# EAGLE design 405_led_jetracer020000N (EAGLE 9.6.2)

## Sheet 1 of 2
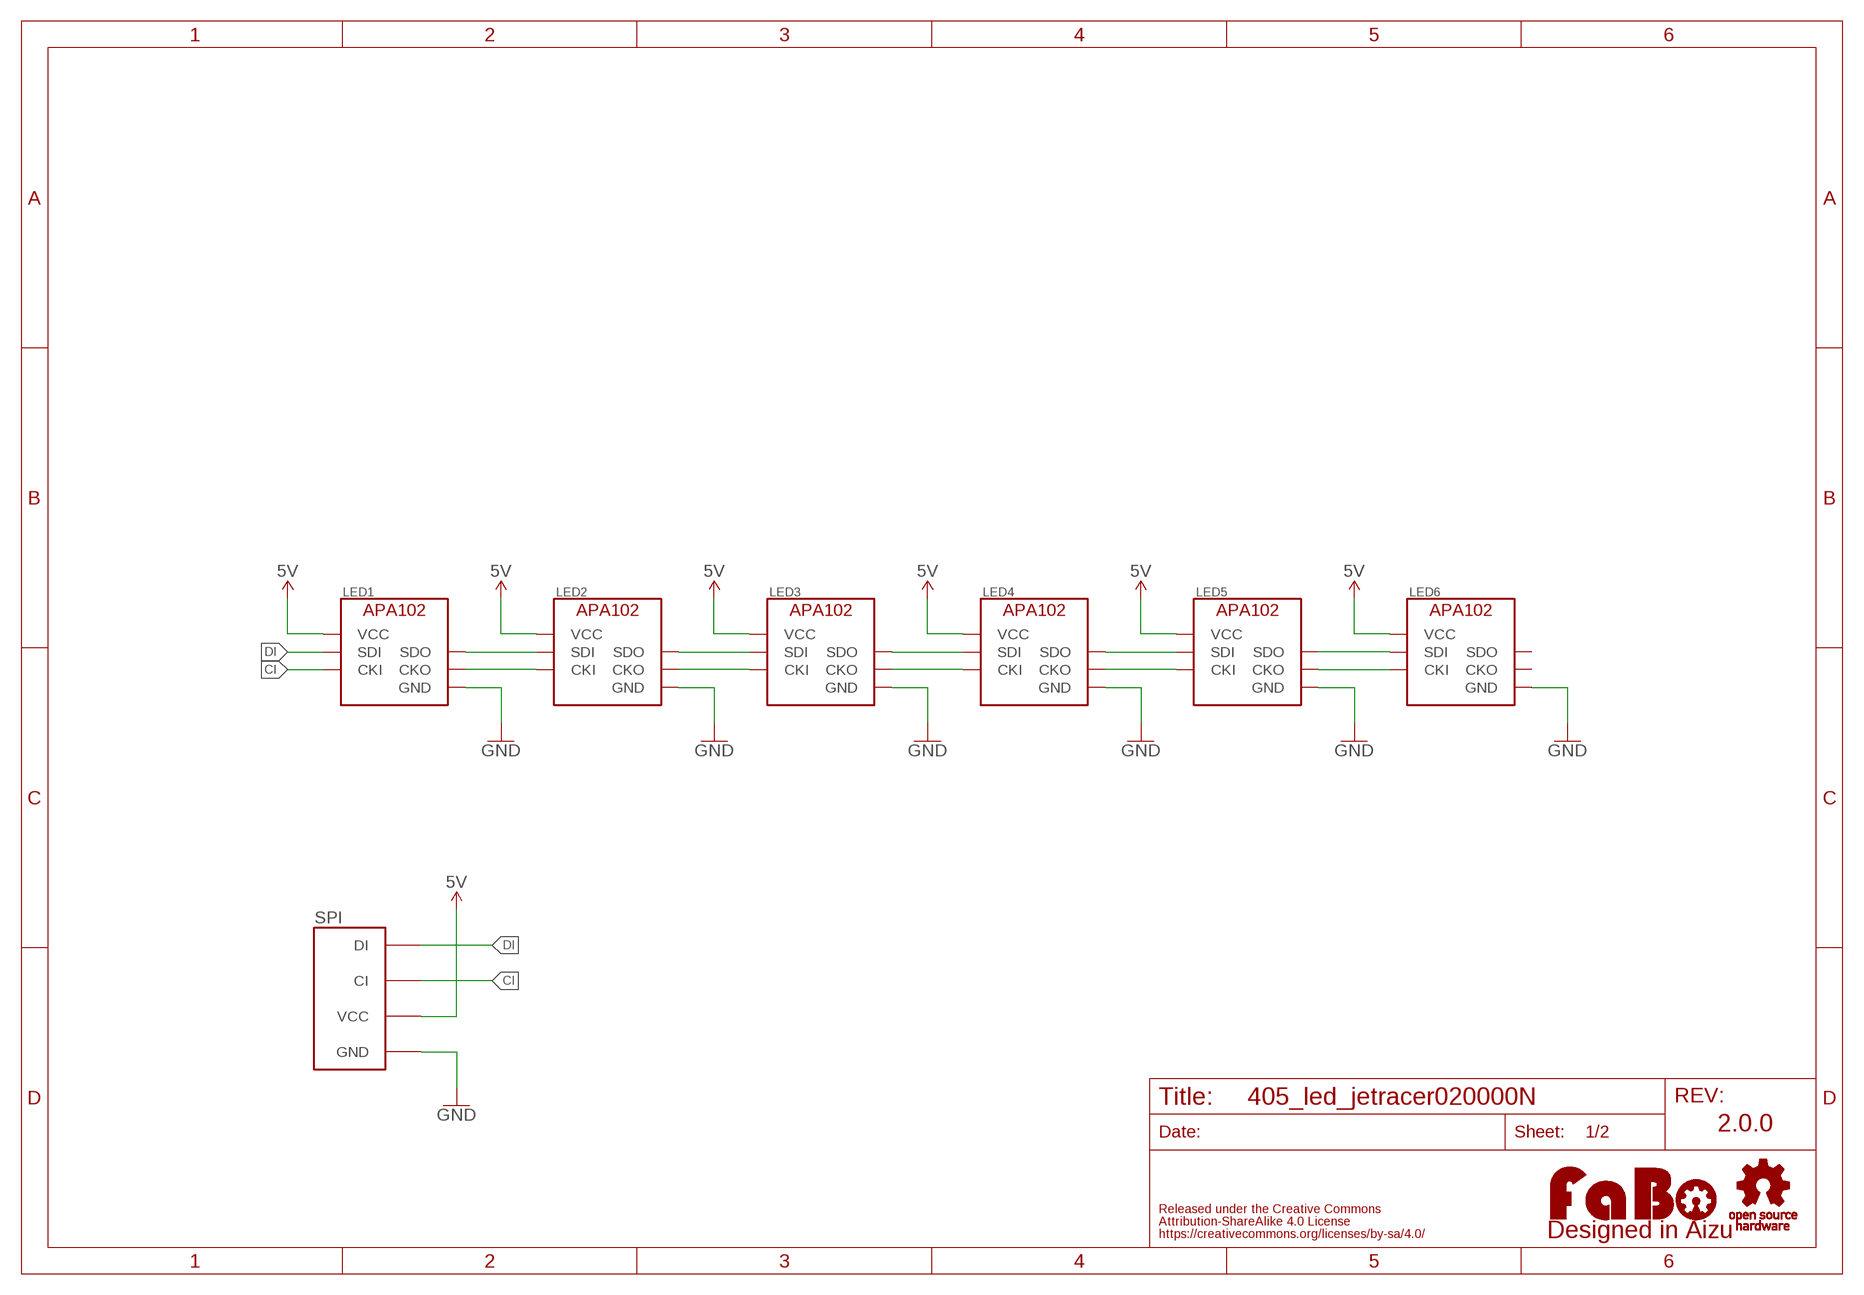
[diagram p0: schematic, sheet 1]

### Parts
LED1  APA102_IPIXEL  [APA102_2020]
LED2  APA102_IPIXEL  [APA102_2020]
LED3  APA102_IPIXEL  [APA102_2020]
LED4  APA102_IPIXEL  [APA102_2020]
LED5  APA102_IPIXEL  [APA102_2020]
LED6  APA102_IPIXEL  [APA102_2020]
LOGO1  LOGO_OSHW-S_BOTTOM  [LOGO_OSHW_S_BOTTOM]
LOGO2  LOGO_FABO-S  [LOGO_FABO_S]
SPI  FABO-SPI-LED-B04B  [SPI-B04B-PASK-1]

### Nets
5V: LED1.VCC LED2.VCC LED3.VCC LED4.VCC LED5.VCC LED6.VCC SPI.VCC
CI: LED1.CKI SPI.CI
CI1: LED1.CKO LED2.CKI
CI2: LED2.CKO LED3.CKI
CI3: LED3.CKO LED4.CKI
CI4: LED4.CKO LED5.CKI
CI5: LED5.CKO LED6.CKI
DI: LED1.SDI SPI.DI
DI1: LED1.SDO LED2.SDI
DI2: LED2.SDO LED3.SDI
DI3: LED3.SDO LED4.SDI
DI4: LED4.SDO LED5.SDI
DI5: LED5.SDO LED6.SDI
GND: LED1.GND LED2.GND LED3.GND LED4.GND LED5.GND LED6.GND SPI.GND
Unconnected: LED6.CKO LED6.SDO

### Notes on the sheet
- 2.0.0

## Sheet 2 of 2
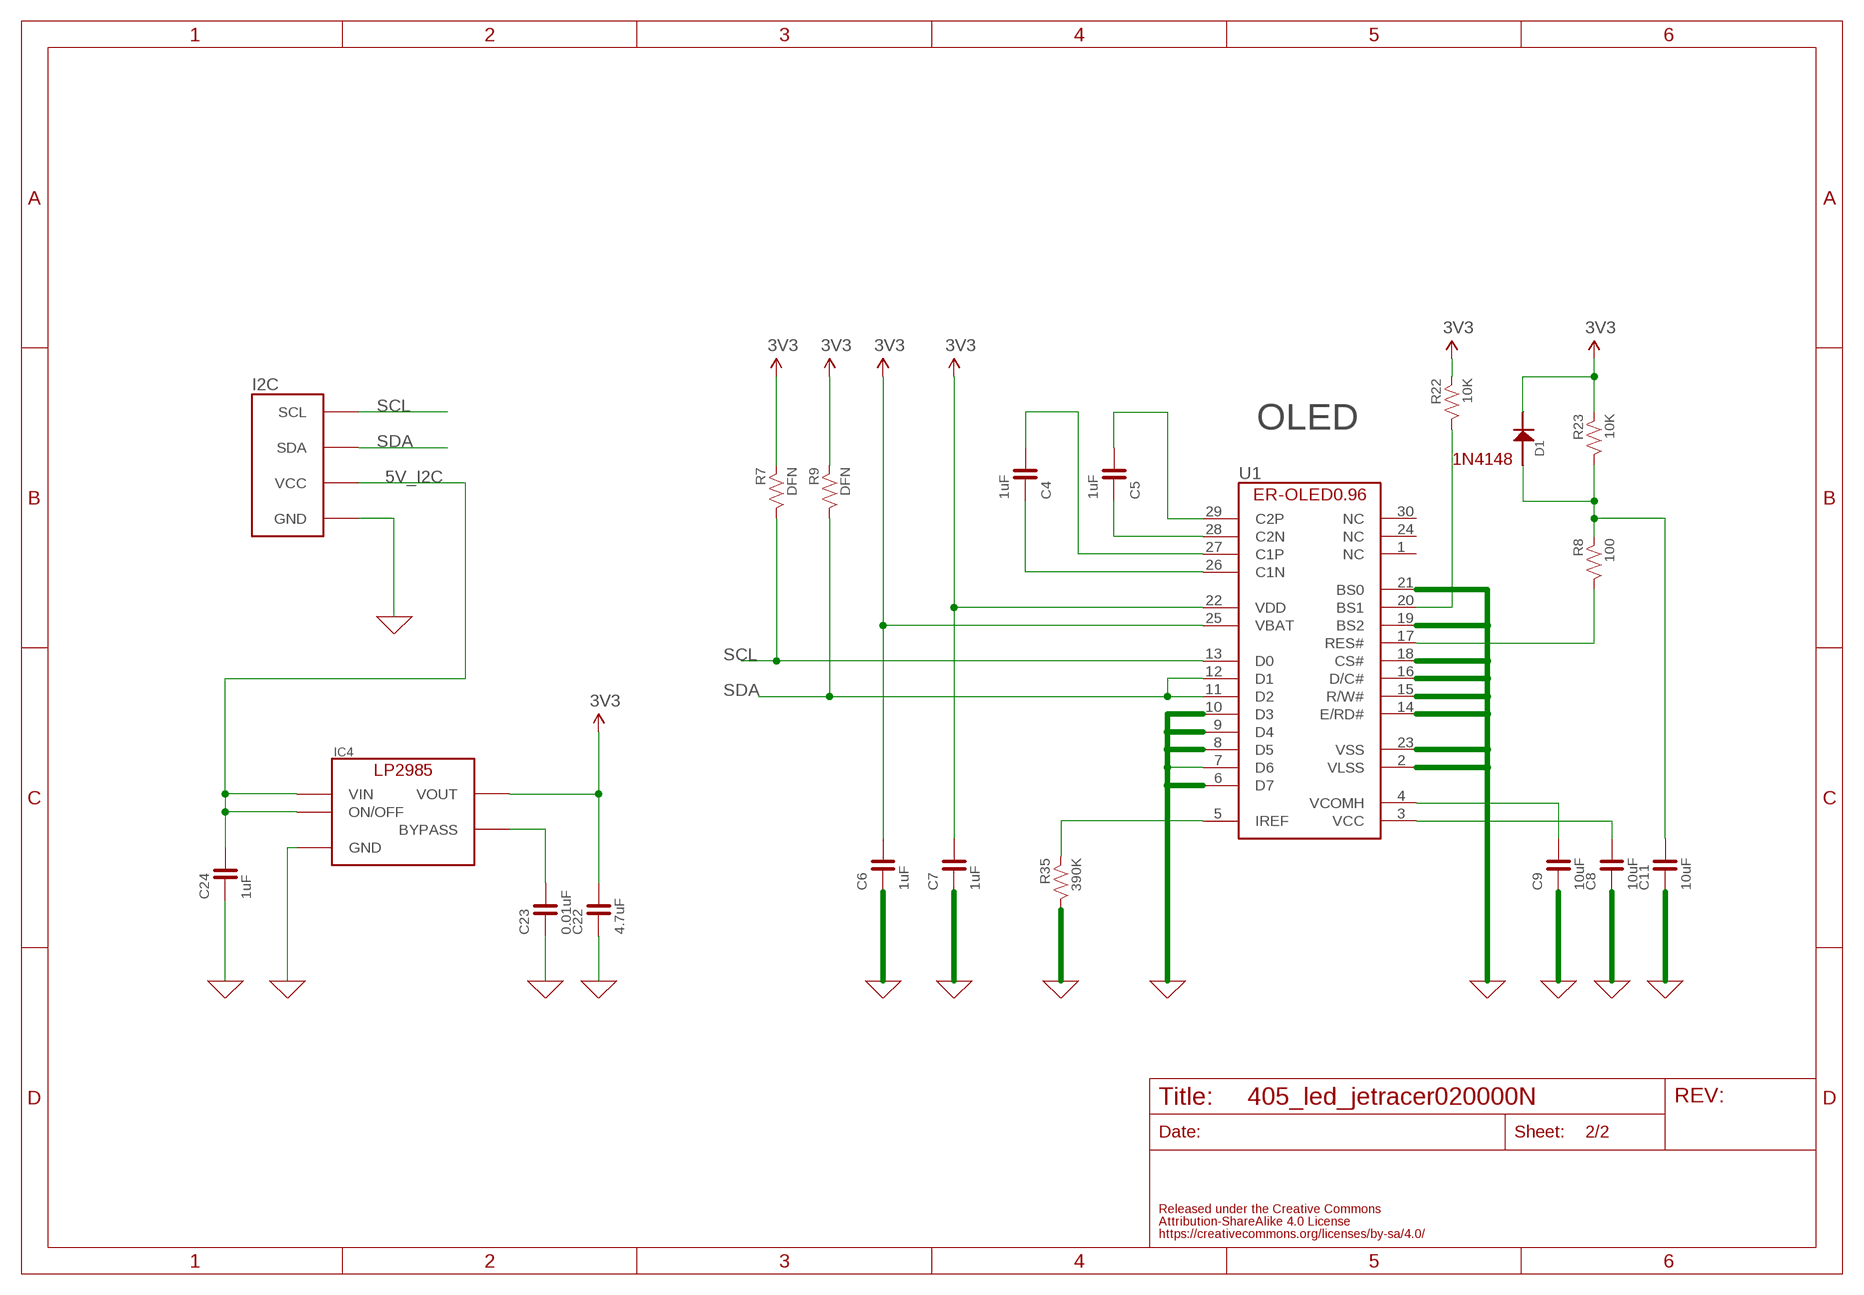
[diagram p1: schematic, sheet 2]

### Parts
C4  1uF  CAPACITOR-0603  [0603]
C5  1uF  CAPACITOR-0603  [0603]
C6  1uF  CAPACITOR-0603  [0603]
C7  1uF  CAPACITOR-0603  [0603]
C8  10uF  CAPACITOR-0603  [0603]
C9  10uF  CAPACITOR-0603  [0603]
C11  10uF  CAPACITOR-0603  [0603]
C22  4.7uF  CAPACITOR-0603  [0603]
C23  0.01uF  CAPACITOR-0603  [0603]
C24  1uF  CAPACITOR-0603  [0603]
D1  1N4148  [1N4148W]
I2C  FABO_BRICK_I2C-B04B-PASK-1  [FABO_BRICK_I2C_B04B-PASK-1]
IC4  LP2985-33DBV  [SOT-23-5]
R7  DFN  RESISTOR-0603  [0603]
R8  100  RESISTOR-0603  [0603]
R9  DFN  RESISTOR-0603  [0603]
R22  10K  RESISTOR-0603  [0603]
R23  10K  RESISTOR-0603  [0603]
R35  390K  RESISTOR-0603  [0603]
U1  ER-OLED0.96-1ER-CON30HT-1  [ER-CON30HT-1]

### Nets
0: C6.1 C7.1 C8.1 C9.1 C11.1 C22.1 C23.1 C24.1 I2C.GND IC4.2(GND) R35.2 U1.2(VLSS) U1.6(D7) U1.7(D6) U1.8(D5) U1.9(D4) U1.10(D3) U1.14(E/RD#) U1.15(R/W#) U1.16(D/C#) U1.18(CS#) U1.19(BS2) U1.21(BS0) U1.23(VSS) ; supply symbol labelled GND
3V3: C6.2 C7.2 C22.2 D1.CATHODE IC4.5(VOUT) R7.1 R9.1 R22.1 R23.1 U1.22(VDD) U1.25(VBAT)
5V_I2C: C24.2 I2C.VCC IC4.1(VIN) IC4.3(ON/OFF)
N$2: C23.2 IC4.4(BYPASS)
N$16: C4.2 U1.27(C1P)
N$21: C4.1 U1.26(C1N)
N$22: C5.1 U1.28(C2N)
N$23: C5.2 U1.29(C2P)
N$24: R35.1 U1.5(IREF)
N$25: C9.2 U1.4(VCOMH)
N$26: C8.2 U1.3(VCC)
N$27: R8.2 U1.17(RES#)
N$28: C11.2 D1.ANODE R8.1 R23.2
N$50: R22.2 U1.20(BS1)
SCL: I2C.SCL R7.2 U1.13(D0)
SDA: I2C.SDA R9.2 U1.11(D2) U1.12(D1)
Unconnected: U1.1(NC) U1.24(NC) U1.30(NC)

### Notes on the sheet
- OLED
- 1N4148

## Library data of the parts
C4-C9 C11 C22-C24 = FaBo-Capacitor:CAPACITOR: CAPACITOR
D1 = FaBo-Diode:1N4148
I2C = FaBo-Template:FABO_BRICK_I2C: FaBo Brick I2C
IC4 = FaBo-Supply:LP2985: LP2985
LED1-LED6 = FaBo-LED:APA102
LOGO1 = FaBo-Logo:LOGO_OSHW
LOGO2 = FaBo-Logo:LOGO_FABO
R7-R9 R22 R23 R35 = FaBo-Resistors:RESISTOR: RESISTOR
SPI = FaBo-Connetor:FABO-SPI-LED
U1 = FaBo-Display:ER-OLED0.96-1

## Board
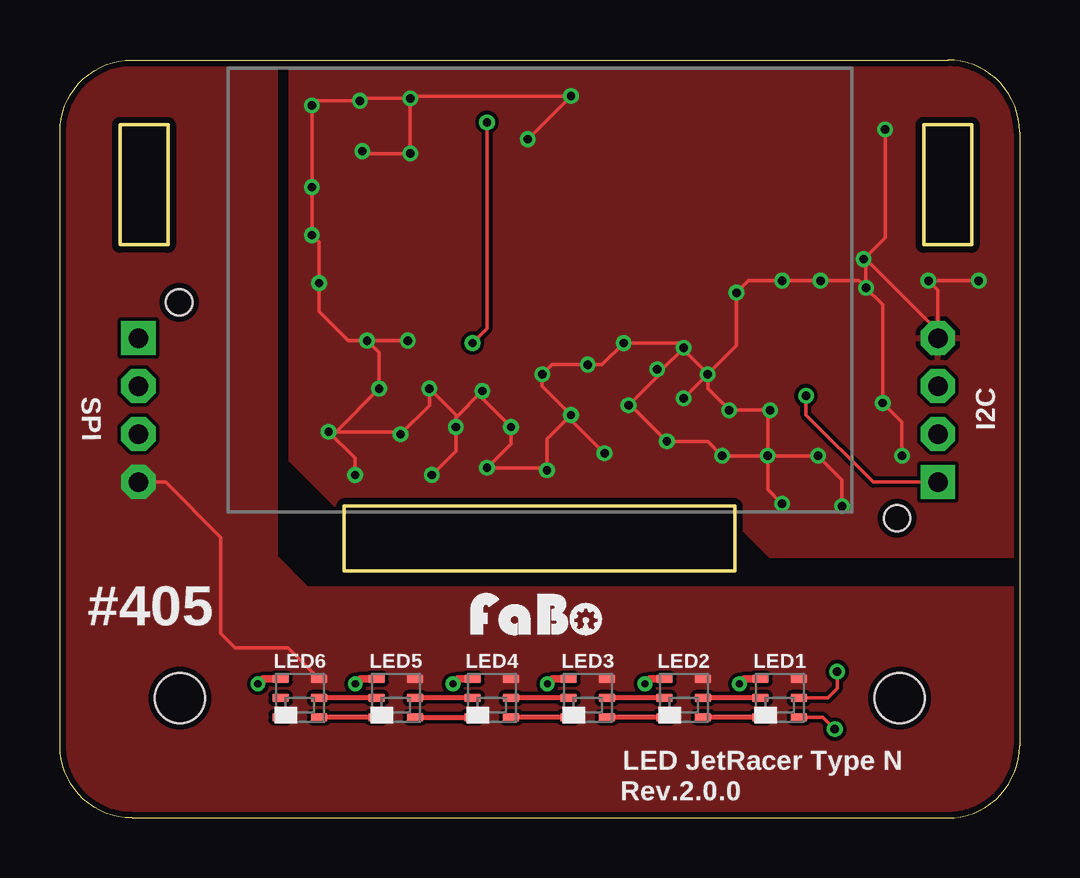
[diagram p2: board, top side]
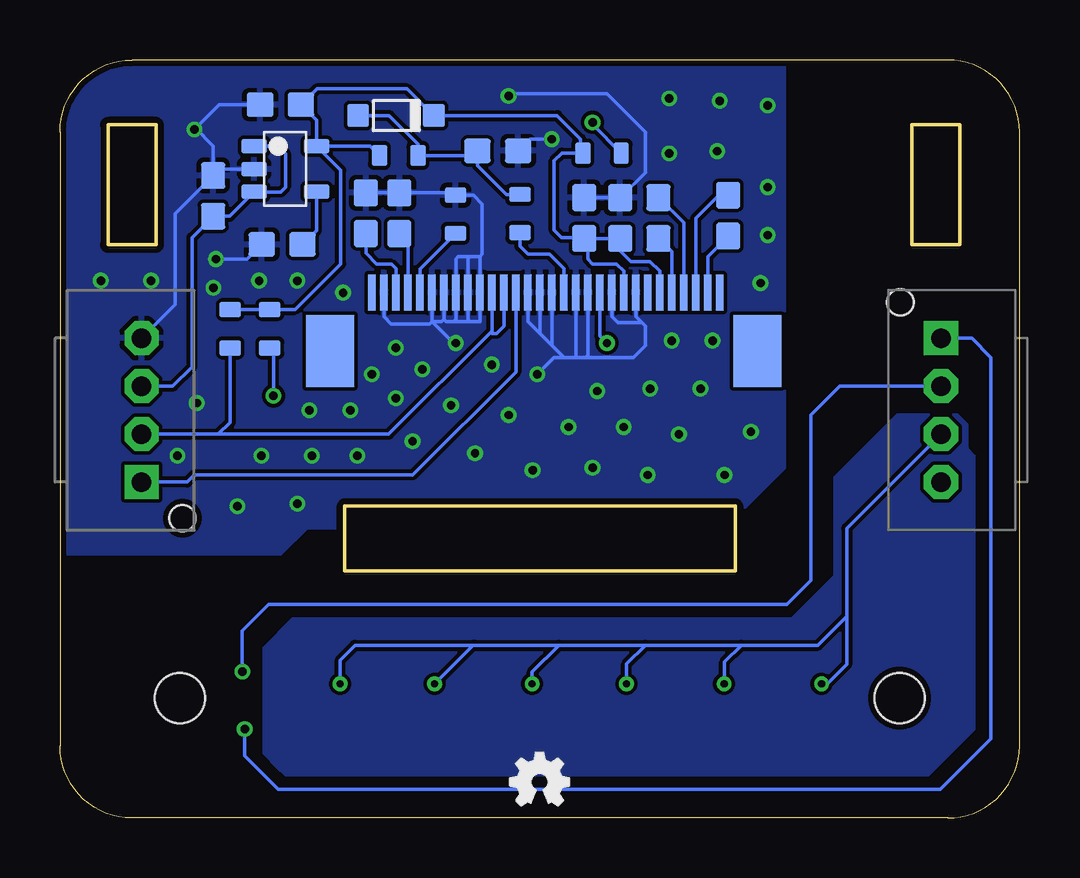
[diagram p3: board, bottom side, seen from below]

Size 40 x 31.6 mm. Coordinates in mm from the lower left corner, seen from the top.
Outline: 3,0 37,0 arc90 40,3 40,28.6 arc90 37,31.6 3,31.6 arc90 0,28.6 0,3 arc90 3,0
Outline: 11.85,10.29 28.13,10.29 28.13,13 11.85,13 11.85,10.29
Outline: 2.5,28.9 4.5,28.9 4.5,23.9 2.5,23.9 2.5,28.9
Outline: 36,28.9 38,28.9 38,23.9 36,23.9 36,28.9
Copper layers (1*16): Top 0.035mm / dielectric 1.6mm / Bottom 0.035mm
Design rules "PCBway": minimum track width 6mil, minimum drill 12mil, track to track 6mil, track to pad 6mil, pad to pad 6mil, via to via 6mil, smd to smd 6mil, copper to edge 10mil, drill to drill 10mil, minimum pad ring 10mil, minimum via ring 6mil, stop-mask expansion 2mil, vias tented up to drill 100mil, thermal gap 8mil
Holes 2.1 mm at 5,5 35,5
bRestrict: 8 lines

### Footprints (pad centres in the part's own frame; a part is rotated, then mirrored left to right if it is on the bottom)
0603 = smd 1.1 x 1: 1 -0.85,0; 2 0.85,0
1N4148W = smd 0.9 x 0.95: ANODE 0,0; CATHODE 3.15,0
FABO_BRICK_I2C_B04B-PASK-1 = drill 0.8 pad 1.422 octagon: GND -3,0; SDA 1,0; VCC -1,0 | drill 0.8 pad 1.422 square: SCL 3,0 | hole 1.1: 4.5,1.7
SOT-23-5 = smd 0.6 x 1.05: 1 -0.95,-1.3; 2 0,-1.3; 3 0.95,-1.3; 4 0.95,1.3; 5 -0.95,1.3
APA102_2020 = smd 0.7 x 0.35: CKI 0.8,0; CKO -0.8,0; GND 0.8,0.8; SDI 0.8,-0.8; SDO -0.8,-0.8; VCC -0.8,0.8
0603' = smd 0.65 x 0.9: 1 -0.8,0; 2 0.8,0
SPI-B04B-PASK-1 = drill 0.8 pad 1.422 octagon: CI 1,1.27; GND -3,1.27; VCC -1,1.27 | drill 0.8 pad 1.422 square: DI 3,1.27 | hole 1.1: 4.5,2.97
ER-CON30HT-1 = smd 0.3 x 1.5 bottom: 1 7,-0.23; 2 6.5,-0.23; 3 6,-0.23; 4 5.5,-0.23; 5 5,-0.23; 6 4.5,-0.23; 7 4,-0.23; 8 3.5,-0.23; 9 3,-0.23; 10 2.5,-0.23; 11 2,-0.23; 12 1.5,-0.23; 13 1,-0.23; 14 0.5,-0.23; 15 0,-0.23; 16 -0.5,-0.23; 17 -1,-0.23; 18 -1.5,-0.23; 19 -2,-0.23; 20 -2.5,-0.23; 21 -3,-0.23; 22 -3.5,-0.23; 23 -4,-0.23; 24 -4.5,-0.23; 25 -5,-0.23; 26 -5.5,-0.23; 27 -6,-0.23; 28 -6.5,-0.23; 29 -7,-0.23; 30 -7.5,-0.23 | smd 2 x 3 bottom: 31 -9.07,-2.67; 32 8.74,-2.67

### Placement (x,y rotation side)
C4  15.05,25.01 90 bottom
C5  12.15,25.11 270 bottom
C6  18.15,25.01 270 bottom
C7  16.65,25.01 270 bottom
C8  27.25,25.21 270 bottom
C9  25.85,25.21 270 bottom
C11  21.75,27.81 180 bottom
C22  30.8,29.73 0 bottom
C23  30.74,23.91 0 bottom
C24  33.62,25.93 270 bottom
D1  27.57,29.28 0 bottom
I2C  36.6,17 270 bottom
IC4  30.61,27.05 270 bottom
LED1  30,5 0 top
LED2  26,5 0 top
LED3  22,5 0 top
LED4  18,5 0 top
LED5  14,5 0 top
LED6  10,5 0 top
LOGO1  20,1.5 0 top
LOGO2  19.91,7.47 0 top
R7  DFN  [0603']  31.25,20.39 270 bottom
R8  100  [0603']  20.83,25.2 270 bottom
R9  DFN  [0603']  32.91,20.39 270 bottom
R22  10K  [0603']  17.41,27.72 0 bottom
R23  10K  [0603']  25.88,27.62 0 bottom
R35  390K  [0603']  23.52,25.17 90 bottom
SPI  2,17 90 bottom
U1  20,22.14 0 top

### Tracks (layer width: path | path; a pad name or v marks a point on that pad's centre or on a via)
0  (via drill 0.35)
  Top 0.152: v19.5,28.3 v21.3,30.1 14.82,30.1 14.6,29.88 | 33.55,23.35 v33.5,23.3 33.6,23.2 v33.6,22.1 | 33.55,23.35 34.4,24.2 v34.4,28.7 | I2C.GND 36.6,20.3 | 36.6,20.3 33.55,23.35 | v11.2,16.1 12.3,15 v12.3,14.3 | 14.6,29.88 v14.6,30 12.6,30 v12.5,29.9 10.7,29.9 v10.5,29.7 v10.5,26.3 v10.5,24.3 10.8,24 v10.8,22.3 10.8,21.11 12.01,19.9 v12.8,19.9 | 14.6,29.88 v14.6,27.7 12.7,27.7 v12.6,27.8 | v12.8,19.9 v14.5,19.9 | v12.8,19.9 13.3,19.4 v13.3,17.9 11.5,16.1 v11.2,16.1 | v11.2,16.1 14.1,16.1 v14.2,16 15.4,17.2 v15.4,17.9 16.5,16.8 v16.5,16.3 | v16.5,16.3 16.5,15.3 v15.5,14.3 | v16.5,16.3 16.5,16.7 v17.6,17.8 17.6,17.5 v18.8,16.3 18.8,15.6 v17.8,14.6 20.2,14.6 v20.3,14.5 20.3,15.8 v21.3,16.8 | v21.3,16.8 20.1,18 v20.1,18.5 20.5,18.9 v22,18.9 22.6,18.9 v23.5,19.8 25.8,19.8 v26,19.6 | v21.3,16.8 21.3,16.6 v22.7,15.2 | v26,19.6 25.1,18.7 v24.9,18.7 24.9,18.4 v23.7,17.2 23.8,17.2 v25.3,15.7 27,15.7 v27.6,15.1 v29.5,15.1 | v29.5,15.1 v31.6,15.1 32.6,14.1 v32.6,13 | v30.1,13.1 29.5,13.7 v29.5,15.1 | v29.5,15.1 29.5,16.9 v29.6,17 v27.9,17 27,17.9 27,18.4 | 27,18.4 v27,18.5 | v27,18.5 26,19.5 v26,19.6 | v26,17.5 26.9,18.4 27,18.4 | v27,18.5 28.2,19.7 v28.2,21.9 28.7,22.4 v30.1,22.4 v31.7,22.4 33.3,22.4 v33.6,22.1 | v33.6,22.1 34.3,21.4 v34.3,17.3 35.1,16.5 v35.1,15.1 | v38.3,22.4 v36.2,22.4 36.6,22 36.6,20.3
  Bottom 0.152: C6.1 C7.1 15.6,26.91 15.6,28.6 17.2,30.2 21.2,30.2 v21.3,30.1 | 22.5,23.4 22.4,23.5 22.4,25.6 22.77,25.97 R35.2 23.61,26.06 C9.1 C8.1 27.35,26.16 27.5,26.16 | 22.5,23.4 U1.10 22.5,20.7 22.9,20.7 | 22.9,23.4 23,23.3 U1.9 23,20.8 22.9,20.7 | 22.9,23.4 22.5,23.4 | 22.9,23.4 23.4,23.4 23.5,23.3 U1.8 23.5,20.8 23.6,20.7 | U1.7 24,20.8 | 24,20.8 23.9,20.7 23.6,20.7 | U1.6 24.5,20.7 | 24.5,20.7 24.1,20.7 24,20.8 | v19.5,28.3 20.41,28.3 C11.1 | 23.6,20.7 22.9,20.7 | U1.23 16,20.9 15.75,20.65 | 15.75,20.65 15.6,20.5 15.6,19.7 16.1,19.2 18.1,19.2 | 18.1,19.2 18.5,19.2 | 20,20.2 U1.15 | U1.18 18.5,19.2 | U1.19 18,19.3 18.1,19.2 | U1.21 17,20.9 16.75,20.65 15.75,20.65 | 27.55,26.16 27.5,26.16 | IC4.2 33.34,27.05 C24.1 | C23.1 32.2,23.3 v33.5,23.3 | v34.4,28.7 34.35,28.75 | 34.35,28.75 33.37,29.73 C22.1 | C24.1 33.62,28.02 34.35,28.75 | 27.5,25.8 27.5,26.16 | 18.5,19.2 19,19.2 | 19,19.2 19.5,19.7 | 19.5,19.7 20,20.2 | U1.16 19.5,19.7 | 20,20.2 20.5,20.7 U1.14 | 24.5,20.7 23.6,19.8 v23.5,19.8 | 19,19.2 19.4,19.2 v20.1,18.5 | U1.2 26.5,20.9 26.2,20.6 24.6,20.6 24.5,20.7 | C24.1 35.2,25.2 35.2,23.93 35.2,21.39 I2C.GND
  pour Bottom (rank 6): 9.8,32.4 12.4,35 39.8,35 42.1,32.7 42.1,12.6 40.5,11 33.3,11 30.8,11 29.7,12.1 12.3,12.1 9.8,14.6 9.8,32.3
  pour Top (rank 6): 9.6,31.6 13.7,35.7 38.5,35.7 42.9,31.3 42.9,12.3 41.5,10.9 29.6,10.9 28.4,12.1 28.4,12.2 12.3,12.2 9.6,14.9
3V3
  Bottom 0.152: U1.25 15,22.8 15.4,23.2 16.2,23.2 16.65,23.65 C7.2 18,24.16 | 18,24.16 C6.2 18.19,24.2 19.1,24.2 19.4,24.5 19.4,27.4 19.08,27.72 18.3,27.72 | U1.22 16.5,22.8 16.8,23.1 17.8,23.1 18,23.3 18,24.16 | 18.3,27.72 R22.1 | 18.3,27.72 18.3,28.3 19.28,29.28 D1.CATHODE 25.54,30.4 29.29,30.4 C22.2 29.3,29.09 IC4.5 | R23.1 27.07,28 IC4.5 | R9.1 R7.1 30.2,21.2 28.3,23.1 28.3,27 IC4.5
5V  (via drill 0.3)
  Top 0.305: LED1.VCC 28.53,5.8 v28.32,5.59 | LED2.VCC 24.6,5.8 v24.38,5.59 | LED3.VCC 20.53,5.8 v20.32,5.59 | LED4.VCC 16.59,5.8 v16.38,5.59 | LED5.VCC 12.53,5.8 v12.32,5.59 | LED6.VCC 8.47,5.8 v8.26,5.59
  Bottom 0.152: SPI.VCC 7.2,12.07 7.2,8.4 | 7.2,8.4 7.2,6.4 8.01,5.59 v8.26,5.59 | v12.32,5.59 12.3,5.61 12.3,6.5 11.6,7.2 | 7.2,8.4 8.4,7.2 11.6,7.2 | v16.38,5.59 16.38,6.42 15.6,7.2 | 15.6,7.2 11.6,7.2 | v20.32,5.59 20.32,6.08 19.2,7.2 | 19.2,7.2 15.6,7.2 | v24.38,5.59 22.77,7.2 | 22.77,7.2 22.7,7.2 19.2,7.2 | v28.32,5.59 28.32,6.58 27.7,7.2 22.77,7.2
5V_I2C
  Bottom 0.152: IC4.1 30.9,28 30.6,27.7 30.6,26.3 30.8,26.1 IC4.3 32.92,25.09 C24.2 34.5,24.2 34.5,18.8 35.3,18 I2C.VCC
%V
  pour Bottom (no thermals): 2.2,15.4 2.2,16.4 2.6,16.8 5.1,16.8 7.7,14.2 7.7,10.1 9.5,8.3 30.3,8.3 31.5,7.1 31.5,2.7 30.9,2.1 30.6,1.8 26,1.8 3.8,1.8 3.2,2.4 1.9,3.7 1.9,14.2 1.9,15.1
CI  (via drill 0.35)
  Top 0.152: v32.4,6.1 32.4,5.4 32,5 LED1.CKI
  Bottom 0.152: SPI.CI 7.5,18 8.7,16.8 8.7,9.9 9.7,8.9 31.3,8.9 32.4,7.8 v32.4,6.1
CI1
  Top 0.203: LED1.CKO LED2.CKI
CI2
  Top 0.203: LED2.CKO LED3.CKI
CI3
  Top 0.203: LED3.CKO LED4.CKI
CI4
  Top 0.203: LED4.CKO LED5.CKI
CI5
  Top 0.203: LED5.CKO LED6.CKI
DI  (via drill 0.35)
  Top 0.152: v32.3,3.7 31.8,4.2 LED1.SDI
  Bottom 0.152: SPI.DI 2,20 1.2,19.2 1.2,3.3 3.3,1.2 30.9,1.2 32.3,2.6 v32.3,3.7
DI1
  Top 0.203: LED1.SDO LED2.SDI
DI2
  Top 0.203: LED2.SDO LED3.SDI
DI3
  Top 0.203: LED3.SDO LED4.SDI
DI4
  Top 0.203: LED5.SDI LED4.SDO
DI5
  Top 0.203: LED5.SDO LED6.SDI
GND
  Top 0.152: SPI.GND 4.4,14 6.7,11.7 6.7,7.7 7.3,7.1 9.5,7.1 LED6.GND
  pour Top (no thermals): -1.1,33.7 6.8,33.7 7.1,33.4 9,31.5 9,10.9 10.3,9.6 22.2,9.6 40.5,9.6 41.5,8.6 41.5,1.4 39,-1.1 38.6,-1.5 0.9,-1.5 -2.3,1.7 -2.3,32.9 -1.5,33.7
  pour Bottom (rank 6, no thermals): -3.9,32.6 -2.3,34.2 6.9,34.2 9.1,32 9.1,10.5 9.8,9.8 40.9,9.8 41.6,9.1 41.6,0.3 39.5,-1.8 0.5,-1.8 -3.9,2.6
N$2
  Bottom 0.152: C23.2 29.3,24.5 IC4.4
N$16
  Bottom 0.152: U1.27 14,24.81 C4.2
N$21
  Bottom 0.152: U1.26 14.5,23.61 C4.1
N$22
  Bottom 0.152: U1.28 13.5,25 12.54,25.96 C5.1
N$23
  Bottom 0.152: C5.2 13,23.41 U1.29
N$24
  Bottom 0.152: R35.1 25,22.89 U1.5
N$25
  Bottom 0.152: U1.4 25.5,24.01 C9.2
N$26
  Bottom 0.152: U1.3 26,22.9 26.18,23.08 26.39,23.08 26.41,23.1 26.8,23.1 27.25,23.55 C8.2
N$27
  Bottom 0.152: U1.17 19,22.9 19.6,23.5 20.5,23.5 20.83,23.83 R8.2
N$28
  Bottom 0.152: R8.1 21.39,26 22.6,27.2 C11.2 | C11.2 | C11.2 22.78,27.62 R23.2 25.08,28.08 26.28,29.28 D1.ANODE
N$50  (via drill 0.35)
  Top 0.152: v17.8,29 17.8,20.4 v17.2,19.8
  Bottom 0.152: U1.20 17.5,20.1 v17.2,19.8 | v17.8,29 17.8,28.91 R22.2
SCL  (via drill 0.35)
  Top 0.152: I2C.SCL 33.9,14 31.1,16.8 v31.1,17.6
  Bottom 0.152: U1.13 21,18.6 25.3,14.3 34.4,14.3 34.7,14 I2C.SCL | v31.1,17.6 31.1,19.44 R7.2
SDA
  Bottom 0.152: I2C.SDA 33.4,16 | 33.4,16 26.3,16 22,20.3 | 22,20.3 22,20.2 21.8,20.2 21.5,20.5 U1.12 | 22,20.3 U1.11 | R9.2 32.91,16.5 33.4,16

### Text on the board
tPlace: #405 | LED JetRacer Type N | Rev.2.0.0
Document: #405 LED JetRacer Type N Rev2.0.0